# Altium schematic sheet ultrasonic_tx.SchDoc: Ultrasonic
size Letter; Author: Kuo, Huang; Organization: Altium Limited; Address1: L3, 12a Rodborough Rd; Address2: Frenchs Forest; Address3: NSW; Address4: Australia 2086; Revision: 2.0; SheetNumber: 6; SheetTotal: 7
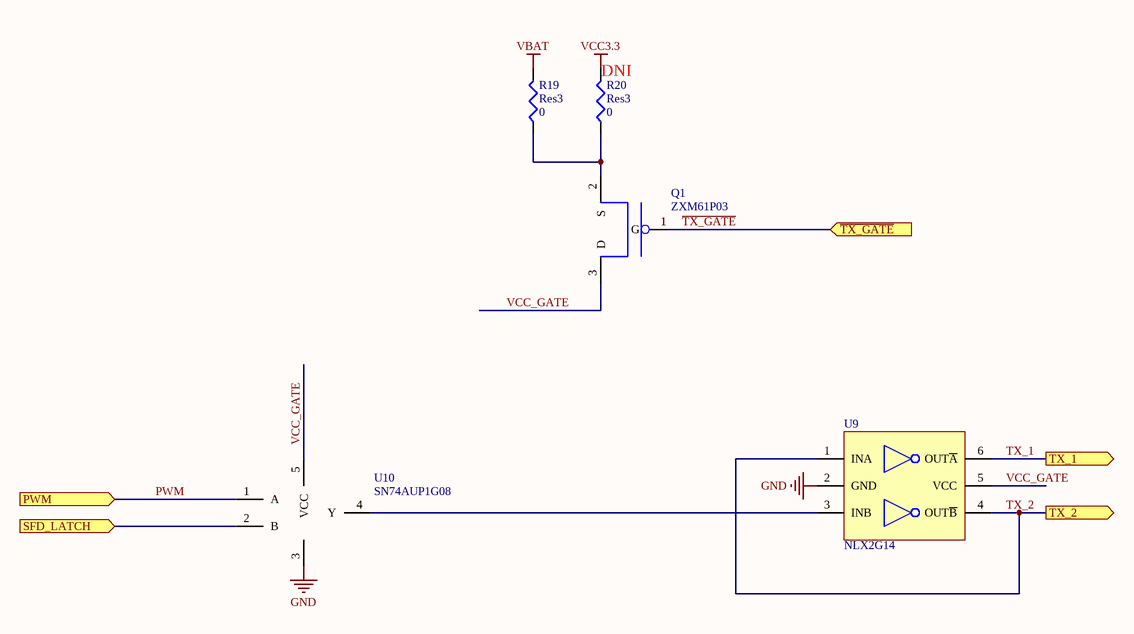
[diagram p0: ultrasonic_tx.SchDoc]

## Parts
Q1  ZXM61P03  [SOT23-3N]
R19  Res3  value 0  [J1-0603]
R20  Res3  value 0  [J1-0603]
U9  NLX2G14  [ULLGA6]
U10  SN74AUP1G08  [SC70-6]

## Ports
PWM (in), SFD_LATCH (in), TX_1 (out), TX_2 (out), ~{TX_GATE} (in)

## Nets
GND: U9.2(GND) U10.3(GND)
VBAT: R19.2
VCC3.3: R20.2
PWM: U10.1(A) ; port PWM
SFD_LATCH: U10.2(B) ; port SFD_LATCH
~{TX_GATE}: Q1.1(G) ; port ~{TX_GATE}
TX_1: U9.6(OUT~{A}) ; port TX_1
TX_2: U9.1(INA) U9.4(OUT~{B}) ; port TX_2
VCC_GATE: Q1.3(D) U9.5(VCC) U10.5(VCC)
NetQ1_2: Q1.2(S) R19.1 R20.1
NetU9_3: U9.3(INB) U10.4(Y)

## Notes on the sheet
- (near R20) DNI
- Title
- Date:
- Author:
- Revision:
- Sheet
- of
- University of Michigan
- File:

## Library data of the parts
Q1 = ZXM61P03: 30V P-CHANNEL ENHANCEMENT MODE MOSFET; Supplier 1: Digi-Key; Supplier Part Number 1: ZXM61P03FCT-ND
R19 R20 = Res3: Resistor; Published: 8-Jun-2000; LatestRevisionDate: 29-May-2009; LatestRevisionNote: IPC-7351 Footprint Added.; PackageReference: J1-0603; Publisher: Altium Limited; PackageDescription: Chip Resistor
U9 = NLX2G14: Dual Schmitt-Trigger  Inverter; Supplier 1: Digi-Key; Supplier Part Number 1: NLX2G14AMX1TCGOSCT-ND
U10 = SN74AUP1G08: LOW-POWER SINGLE 2-INPUT POSITIVE-AND GATE; Supplier 1: Digi-Key; Supplier Part Number 1: 296-19074-1-ND